# Altium schematic sheet [01] - COVER PAGE.SchDoc
size A3; DocumentNumber: 1; SheetNumber: 1; SheetTotal: 20
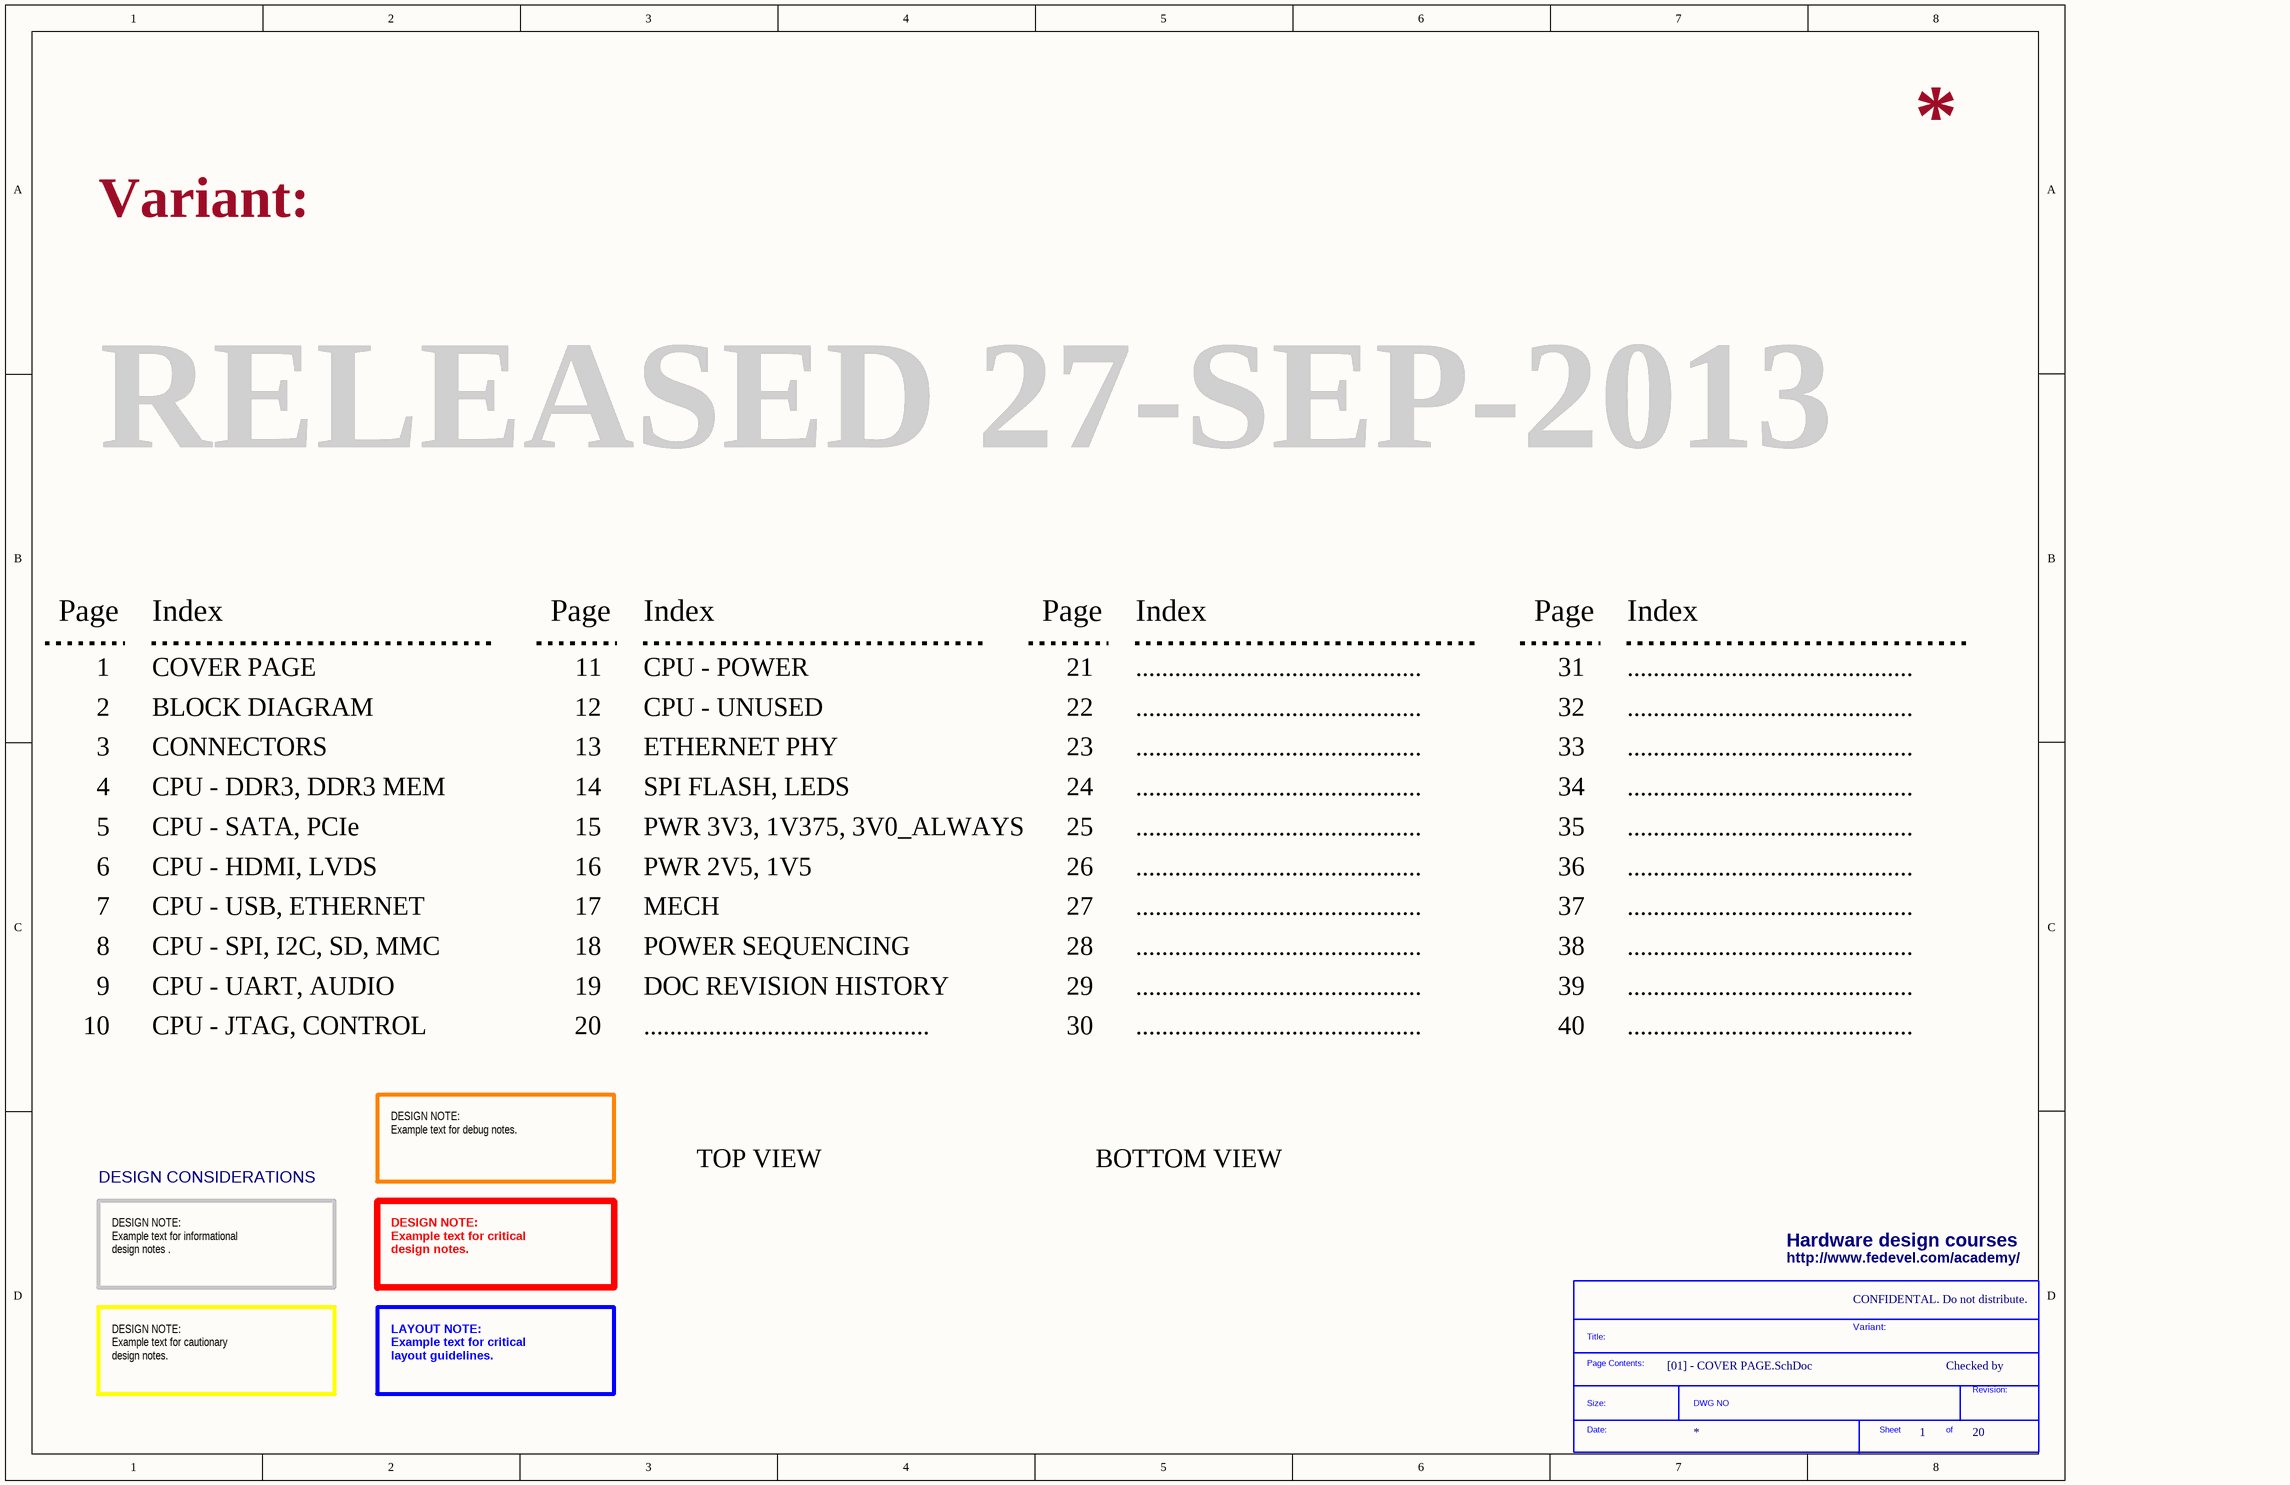
[diagram p0: [01] - COVER PAGE.SchDoc]

## Parts
*  SDTitleBlock  (value not drawn)  (graphical)

## Notes on the sheet
- Variant:
- RELEASED 27-SEP-2013
- Page
- Index
- 1
- COVER PAGE
- 11
- CPU - POWER
- 21
- ............................................
- 31
- 2
- 3
- BLOCK DIAGRAM
- CONNECTORS
- 12
- 13
- CPU - UNUSED
- ETHERNET PHY
- 22
- 23
- 32
- 33
- 4
- 5
- CPU - DDR3, DDR3 MEM
- CPU - SATA, PCIe
- 14
- 15
- SPI FLASH, LEDS
- PWR 3V3, 1V375, 3V0_ALWAYS
- 24
- 25
- 34
- 35
- 6
- CPU - HDMI, LVDS
- 16
- PWR 2V5, 1V5
- 26
- 36
- 7
- 8
- CPU - USB, ETHERNET
- CPU - SPI, I2C, SD, MMC
- 17
- 18
- MECH
- POWER SEQUENCING
- 27
- 28
- 37
- 38
- 9
- 10
- CPU - UART, AUDIO
- CPU - JTAG, CONTROL
- 19
- 20
- DOC REVISION HISTORY
- 29
- 30
- 39
- 40
- DESIGN NOTE:
  Example text for debug notes.
- TOP VIEW
- BOTTOM VIEW
- DESIGN CONSIDERATIONS
- Hardware design courses
- DESIGN NOTE:
  Example text for informational
  design notes .
- DESIGN NOTE:
  Example text for critical
  design notes.
- http://www.fedevel.com/academy/
- CONFIDENTAL. Do not distribute.
- Checked by
- DESIGN NOTE:
  Example text for cautionary
  design notes.
- LAYOUT NOTE:
  Example text for critical
  layout guidelines.
- (in symbol SDTitleBlock) Title:; Page Contents:; Revision:; Size:; DWG NO; Date:; Sheet; of